# EAGLE schematic 2x2 Platine (EAGLE 9.5.1)
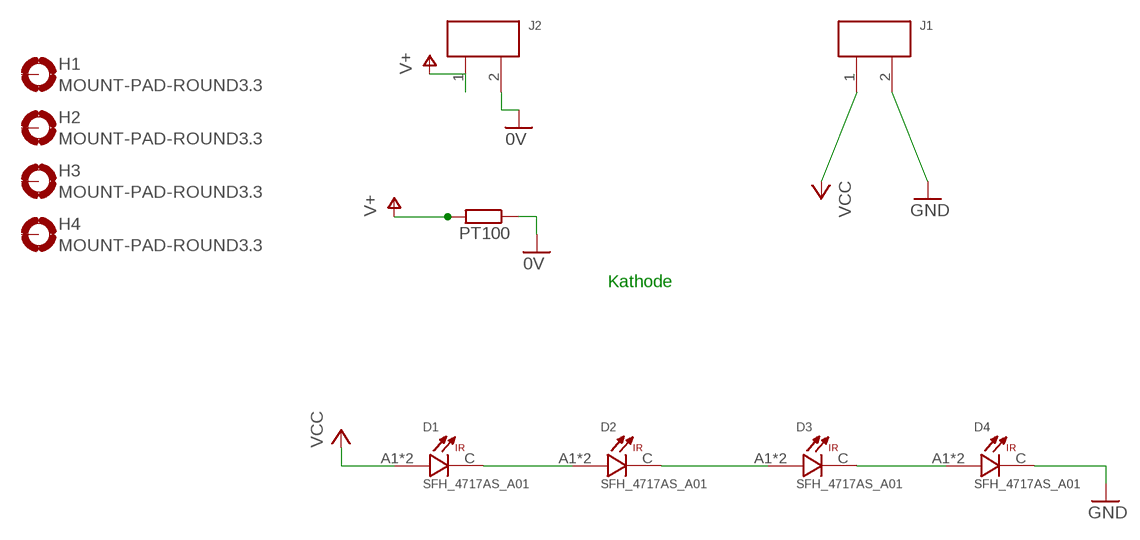
[diagram p0: schematic, sheet 1]

## Parts
D1  SFH_4717AS_A01  [LED_SFH_4717AS_A01]
D2  SFH_4717AS_A01  [LED_SFH_4717AS_A01]
D3  SFH_4717AS_A01  [LED_SFH_4717AS_A01]
D4  SFH_4717AS_A01  [LED_SFH_4717AS_A01]
H1  MOUNT-PAD-ROUND3.3  [3,3-PAD]
H2  MOUNT-PAD-ROUND3.3  [3,3-PAD]
H3  MOUNT-PAD-ROUND3.3  [3,3-PAD]
H4  MOUNT-PAD-ROUND3.3  [3,3-PAD]
J1  662102145021  [662102145021]
J2  662102145021  [662102145021]
PT100  R-EU_R0603  [R0603]

## Nets
0V: J2.2 PT100.1
GND: D4.C J1.2
N$1: D1.C D2.A1(A) D2.A2(A)
N$2: D2.C D3.A1(A) D3.A2(A)
N$3: D3.C D4.A1(A) D4.A2(A)
V+: J2.1 PT100.2
VCC: D1.A1(A) D1.A2(A) J1.1
Unconnected: H1.B3,3(MOUNT) H2.B3,3(MOUNT) H3.B3,3(MOUNT) H4.B3,3(MOUNT)

## Notes on the sheet
- Kathode

## Library data of the parts
D1-D4 = SFH_4717AS_A01:SFH_4717AS_A01: OSLON Black Series (850 nm) - 50°; AVAILABILITY: Unavailable; DESCRIPTION: EMITTER IR; MF: OSRAM Opto; MP: SFH 4717AS A01; PACKAGE: 1515 OSRAM Opto Semiconductors Inc.; PRICE: None
H1-H4 = holes:MOUNT-PAD-ROUND: MOUNTING PAD, round
J1 J2 = 662104145021_Eagle_WR-MPC3_rev19a:662102145021: WR-MPC3 3.00mm Male Single Row SMT Angled Header SMT Fitting Nail Clip, 2 Pins=>Code : Con_WTB_MPC3_1_PCB_662102145021 <http://katalog.we-online.de/media/thumbs2/eican/thb_Con_WTB_MPC3_1_PCB_6621xx145021_pf2.jpg> Details see: http://katalog.we-online.de/en/em/MPC3_3_00_MALE_SINGLE_ROW_ANGLED_HEADER_6621XX145021 Created 2014-06-06, Karrer Zheng 2014 (C) Würth Elektronik
PT100 = resistor:R-EU_: RESISTOR, European symbol